# Altium schematic sheet WallDigitalClock.SchDoc
size 594 x 420 mm; Address1: Address1; Address2: Address2; Address3: Address3; Address4: Address4; SheetNumber: 1; Scale: 1:1; Разраб.: Иванов; Обозначение документа: АБВГ.123456.001 Э3; Пров.: Петров; Утв.: Сидоров; Наименование организации: ОАО "Концерн "МПО-Гидроприбор"; Перв. применение: АБВГ.123456.000; Наименование изделия 1: Плата; Наименование изделия 2: Схема электрическая; Наименование изделия 3: принципиальная; Нач. отд.: Нач. отд.; Фамилия нач. отд.: Сидоров
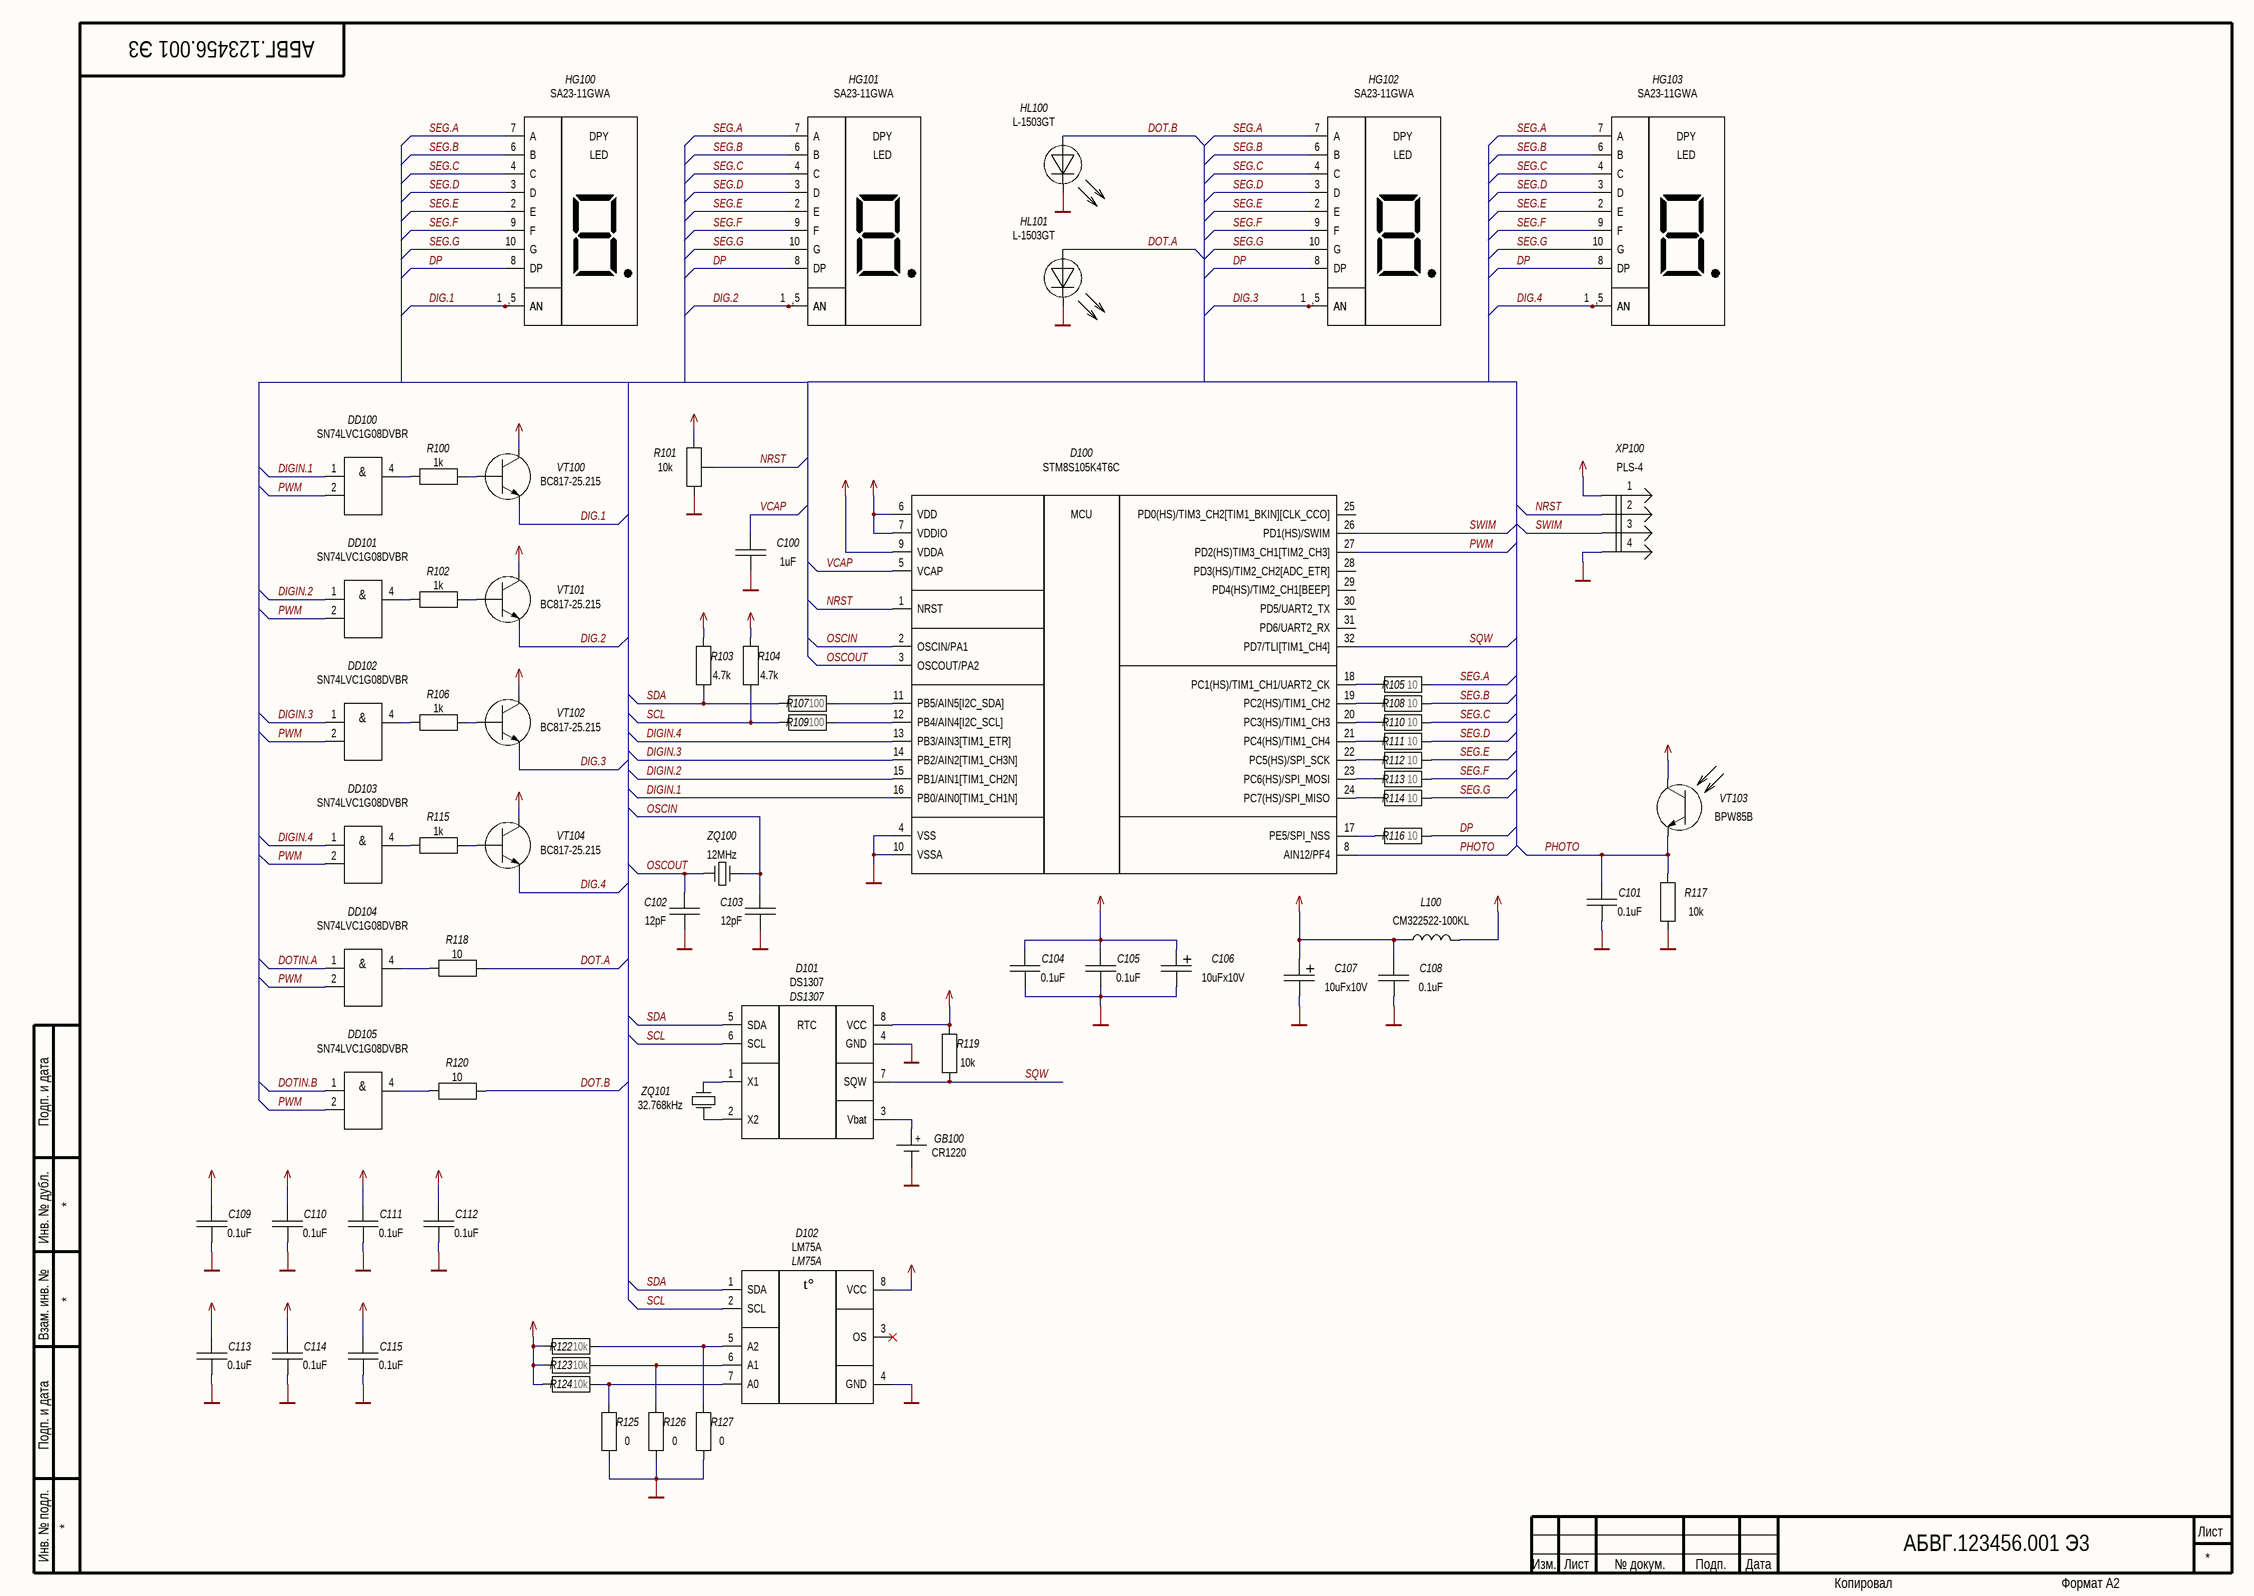
[diagram p0: WallDigitalClock.SchDoc]

## Parts
C100  value 1uF  [CAP0603RS]  (hidden comment: Capacitor)
C101  value 0.1uF  [CAP0603RS]  (hidden comment: Capacitor)
C102  value 12pF  [CAP0603RS]  (hidden comment: Capacitor)
C103  value 12pF  [CAP0603RS]  (hidden comment: Capacitor)
C104  value 0.1uF  [CAP0603RS]  (hidden comment: Capacitor)
C105  value 0.1uF  [CAP0603RS]  (hidden comment: Capacitor)
C106  value 10uFx10V  [Type-C]  (hidden comment: Capacitor_Pol)
C107  value 10uFx10V  [Type-C]  (hidden comment: Capacitor_Pol)
C108  value 0.1uF  [CAP0603RS]  (hidden comment: Capacitor)
C109  value 0.1uF  [CAP0603RS]  (hidden comment: Capacitor)
C110  value 0.1uF  [CAP0603RS]  (hidden comment: Capacitor)
C111  value 0.1uF  [CAP0603RS]  (hidden comment: Capacitor)
C112  value 0.1uF  [CAP0603RS]  (hidden comment: Capacitor)
C113  value 0.1uF  [CAP0603RS]  (hidden comment: Capacitor)
C114  value 0.1uF  [CAP0603RS]  (hidden comment: Capacitor)
C115  value 0.1uF  [CAP0603RS]  (hidden comment: Capacitor)
D100  STM8S105K4T6C  [LQFP32]
D101  DS1307  [SO8]
D102  LM75A  [SO8]
DD100  value SN74LVC1G08DVBR  [SOT23-5]  (hidden comment: SN74LVC1G08)
DD101  value SN74LVC1G08DVBR  [SOT23-5]  (hidden comment: SN74LVC1G08)
DD102  value SN74LVC1G08DVBR  [SOT23-5]  (hidden comment: SN74LVC1G08)
DD103  value SN74LVC1G08DVBR  [SOT23-5]  (hidden comment: SN74LVC1G08)
DD104  value SN74LVC1G08DVBR  [SOT23-5]  (hidden comment: SN74LVC1G08)
DD105  value SN74LVC1G08DVBR  [SOT23-5]  (hidden comment: SN74LVC1G08)
GB100  value CR1220  [CR1220_HOLDER]  (hidden comment: *)
HG100  value SA23-11GWA  [SA23-11]  (hidden comment: SA23-11)
HG101  value SA23-11GWA  [SA23-11]  (hidden comment: SA23-11)
HG102  value SA23-11GWA  [SA23-11]  (hidden comment: SA23-11)
HG103  value SA23-11GWA  [SA23-11]  (hidden comment: SA23-11)
HL100  value L-1503GT  [LED_5mm_Green]  (hidden comment: Green)
HL101  value L-1503GT  [LED_5mm_Green]  (hidden comment: Green)
L100  value CM322522-100KL  [IND1210]  (hidden comment: Inductor)
R100  value 1k  [RES0603WS]  (hidden comment: Resistor)
R101  value 10k  [RES0603JMP-RS]  (hidden comment: Res_JMP)
R102  value 1k  [RES0603WS]  (hidden comment: Resistor)
R103  value 4.7k  [RES0805WS]  (hidden comment: Resistor)
R104  value 4.7k  [RES0805WS]  (hidden comment: Resistor)
R105  value 10  [RES0805RS]  (hidden comment: Resistor)
R106  value 1k  [RES0603WS]  (hidden comment: Resistor)
R107  value 100  [RES0603WS]  (hidden comment: Resistor)
R108  value 10  [RES0805RS]  (hidden comment: Resistor)
R109  value 100  [RES0603WS]  (hidden comment: Resistor)
R110  value 10  [RES0805RS]  (hidden comment: Resistor)
R111  value 10  [RES0805RS]  (hidden comment: Resistor)
R112  value 10  [RES0805RS]  (hidden comment: Resistor)
R113  value 10  [RES0805RS]  (hidden comment: Resistor)
R114  value 10  [RES0805RS]  (hidden comment: Resistor)
R115  value 1k  [RES0603WS]  (hidden comment: Resistor)
R116  value 10  [RES0805RS]  (hidden comment: Resistor)
R117  value 10k  [RES0603WS]  (hidden comment: Resistor)
R118  value 10  [RES0603WS]  (hidden comment: Resistor)
R119  value 10k  [RES0805WS]  (hidden comment: Resistor)
R120  value 10  [RES0603WS]  (hidden comment: Resistor)
R122  value 10k  [RES0603WS]  (hidden comment: Resistor)
R123  value 10k  [RES0603WS]  (hidden comment: Resistor)
R124  value 10k  [RES0603WS]  (hidden comment: Resistor)
R125  value 0  [RES0603WS]  (hidden comment: Resistor)
R126  value 0  [RES0603WS]  (hidden comment: Resistor)
R127  value 0  [RES0603WS]  (hidden comment: Resistor)
VT100  value BC817-25.215  [SOT-23]  (hidden comment: NPN)
VT101  value BC817-25.215  [SOT-23]  (hidden comment: NPN)
VT102  value BC817-25.215  [SOT-23]  (hidden comment: NPN)
VT103  value BPW85B  [LED_5mm_Clear]  (hidden comment: Photo_Transistor)
VT104  value BC817-25.215  [SOT-23]  (hidden comment: NPN)
XP100  value PLS-4  [PLS-4-2.54]  (hidden comment: MaleConn_4_pin)
ZQ100  value 12MHz  [HC-49SM]  (hidden comment: *)
ZQ101  value 32.768kHz  [KX-327S]  (hidden comment: *)

## Nets
GND: C100.2 C101.2 C102.2 C103.2 C104.2 C105.2 C106.2 C107.2 C108.2 C109.2 C110.2 C111.2 C112.2 C113.2 C114.2 C115.2 D100.4(VSS) D100.10(VSSA) D101.4(GND) D102.4(GND) DD100.3(GND) DD101.3(GND) DD102.3(GND) DD103.3(GND) DD104.3(GND) DD105.3(GND) GB100.2 HL100.1 HL101.1 R101.3 R117.2 R125.2 R126.2 R127.2 XP100.4
VCC: C104.1 C105.1 C106.1 C109.1 C110.1 C111.1 C112.1 C113.1 C114.1 C115.1 D100.6(VDD) D100.7(VDDIO) D101.8(VCC) D102.8(VCC) DD100.5(VCC) DD101.5(VCC) DD102.5(VCC) DD103.5(VCC) DD104.5(VCC) DD105.5(VCC) L100.1 R101.1 R103.1 R104.1 R119.1 R122.1 R123.1 R124.1 VT100.C VT101.C VT102.C VT104.C XP100.1
VCCA: C107.1 C108.1 D100.9(VDDA) L100.2 VT103.C
DIG.1: HG100.1(AN) HG100.5(AN) VT100.E
DIG.2: HG101.1(AN) HG101.5(AN) VT101.E
DIG.3: HG102.1(AN) HG102.5(AN) VT102.E
DIG.4: HG103.1(AN) HG103.5(AN) VT104.E
DIGIN.1: D100.16(PB0/AIN0[TIM1_CH1N]) DD100.1(A)
DIGIN.2: D100.15(PB1/AIN1[TIM1_CH2N]) DD101.1(A)
DIGIN.3: D100.14(PB2/AIN2[TIM1_CH3N]) DD102.1(A)
DIGIN.4: D100.13(PB3/AIN3[TIM1_ETR]) DD103.1(A)
DOT.A: HL101.2 R118.2
DOT.B: HL100.2 R120.2
DOTIN.A: DD104.1(A)
DOTIN.B: DD105.1(A)
DP: HG100.8(DP) HG101.8(DP) HG102.8(DP) HG103.8(DP) R116.2
NRST: D100.1(NRST) R101.2 XP100.2
OSCIN: C103.1 D100.2(OSCIN/PA1) ZQ100.2
OSCOUT: C102.1 D100.3(OSCOUT/PA2) ZQ100.1
PHOTO: C101.1 D100.8(AIN12/PF4) R117.1 VT103.E
PWM: D100.27(PD2(HS)TIM3_CH1[TIM2_CH3]) DD100.2(B) DD101.2(B) DD102.2(B) DD103.2(B) DD104.2(B) DD105.2(B)
SCL: D101.6(SCL) D102.2(SCL) R104.2 R109.1
SDA: D101.5(SDA) D102.1(SDA) R103.2 R107.1
SEG.A: HG100.7(A) HG101.7(A) HG102.7(A) HG103.7(A) R105.2
SEG.B: HG100.6(B) HG101.6(B) HG102.6(B) HG103.6(B) R108.2
SEG.C: HG100.4(C) HG101.4(C) HG102.4(C) HG103.4(C) R110.2
SEG.D: HG100.3(D) HG101.3(D) HG102.3(D) HG103.3(D) R111.2
SEG.E: HG100.2(E) HG101.2(E) HG102.2(E) HG103.2(E) R112.2
SEG.F: HG100.9(F) HG101.9(F) HG102.9(F) HG103.9(F) R113.2
SEG.G: HG100.10(G) HG101.10(G) HG102.10(G) HG103.10(G) R114.2
SQW: D100.32(PD7/TLI[TIM1_CH4]) D101.7(SQW) R119.2
SWIM: D100.26(PD1(HS)/SWIM) XP100.3
VCAP: C100.1 D100.5(VCAP)
NetD100_11: D100.11(PB5/AIN5[I2C_SDA]) R107.2
NetD100_12: D100.12(PB4/AIN4[I2C_SCL]) R109.2
NetD100_17: D100.17(PE5/SPI_NSS) R116.1
NetD100_18: D100.18(PC1(HS)/TIM1_CH1/UART2_CK) R105.1
NetD100_19: D100.19(PC2(HS)/TIM1_CH2) R108.1
NetD100_20: D100.20(PC3(HS)/TIM1_CH3) R110.1
NetD100_21: D100.21(PC4(HS)/TIM1_CH4) R111.1
NetD100_22: D100.22(PC5(HS)/SPI_SCK) R112.1
NetD100_23: D100.23(PC6(HS)/SPI_MOSI) R113.1
NetD100_24: D100.24(PC7(HS)/SPI_MISO) R114.1
NetD101_1: D101.1(X1) ZQ101.1
NetD101_2: D101.2(X2) ZQ101.2
NetD101_3: D101.3(Vbat) GB100.1
NetD102_5: D102.5(A2) R122.2 R127.1
NetD102_6: D102.6(A1) R123.2 R126.1
NetD102_7: D102.7(A0) R124.2 R125.1
NetDD100_4: DD100.4(Y) R100.1
NetDD101_4: DD101.4(Y) R102.1
NetDD102_4: DD102.4(Y) R106.1
NetDD103_4: DD103.4(Y) R115.1
NetDD104_4: DD104.4(Y) R118.1
NetDD105_4: DD105.4(Y) R120.1
NetR100_2: R100.2 VT100.B
NetR102_2: R102.2 VT101.B
NetR106_2: R106.2 VT102.B
NetR115_2: R115.2 VT104.B

Not connected (* = marked no-connect by the designer): D100 25(PD0(HS)/TIM3_CH2[TIM1_BKIN][CLK_CCO]) 28(PD3(HS)/TIM2_CH2[ADC_ETR]) 29(PD4(HS)/TIM2_CH1[BEEP]) 30(PD5/UART2_TX) 31(PD6/UART2_RX); D102 3(OS)*

## Notes on the sheet
- Подп. и дата
- Инв. № дубл.
- Взам. инв. №
- Инв. № подл.
- Изм.
- Лист
- № докум.
- Подп.
- Дата
- Копировал
- Формат А2
- (in symbol Capacitor_Pol) +
- (in symbol DS1307) RTC
- (in symbol LM75A) t°
- (in symbol SA23-11) DPY; LED; ,
- (in symbol Single_Battety) +
- (in symbol SN74LVC1G08) &
- (in symbol STM8S105K4T6C) MCU

## Library data of the parts
C106 C107 = Capacitor_Pol: Manufacturer: Vishay; HelpURL: https://www.vishay.com/docs/40002/293d.pdf
D100 = STM8S105K4T6C: MCU 8bit, STM8 CISC, Package LQFP-32; Manufacturer: ST Microelectronics; HelpURL: https://www.st.com/resource/en/datasheet/stm8s105k4.pdf; Value: STM8S105K4T6C
D101 = DS1307: Real-time clock (RTC); Manufacturer: *; HelpURL: https://static.chipdip.ru/lib/041/DOC000041914.pdf; Value: DS1307
D102 = LM75A: Digital temperature sensor and thermal watchdog; Manufacturer: *; HelpURL: https://static.chipdip.ru/lib/301/DOC000301694.pdf; Value: LM75A
DD100-DD105 = SN74LVC1G08: Single 2-Input Positive-AND Gate; Manufacturer: Texas Instruments; HelpURL: http://www.ti.com/lit/ds/symlink/sn74lvc1g08.pdf
GB100 = Single_Battety: Holder for single battery; Manufacturer: *; HelpURL: *
HG100-HG103 = SA23-11: Single Digit Numeric Display 57mm (2.3INCH), Common Anode; Manufacturer: Kingbright; HelpURL: https://www.chipdip.ru/product/sa23-11gwa?from=visited_product
HL100 HL101 = LED: HelpURL: *; Manufacturer: *
L100 = Inductor: Manufacturer: Bourns; HelpURL: https://www.bourns.com/docs/Product-Datasheets/cm322522.pdf
R101 = Res_JMP: Jumper two way on resistor; HelpURL: *; Manufacturer: *
VT100-VT102 VT104 = NPN: pin to pad: B>1 C>3 E>2; HelpURL: *; Manufacturer: *
VT103 = Photo_Transistor: pin to pad: C>2 E>1; Manufacturer: Vishay; HelpURL: https://static.chipdip.ru/lib/052/DOC000052462.pdf
ZQ100 = Crystal_Oscillator: HelpURL: *; Manufacturer: *
ZQ101 = Crystal_Oscillator: pin to pad: 2>4; HelpURL: *; Manufacturer: *
C100-C105 C108-C115 = Capacitor: Manufacturer: *; HelpURL: *
R100 R102-R120 R122-R127 = Resistor: HelpURL: *; Manufacturer: *
XP100 = MaleConn_4_pin: HelpURL: *; Manufacturer: *